# EAGLE design batt-monitor (EAGLE 5.12)
BOM: EXCLUDE; DATABASE: ./partsdb.txt; PARTNO: 1KSMB36CA

## Sheet 1 of 3
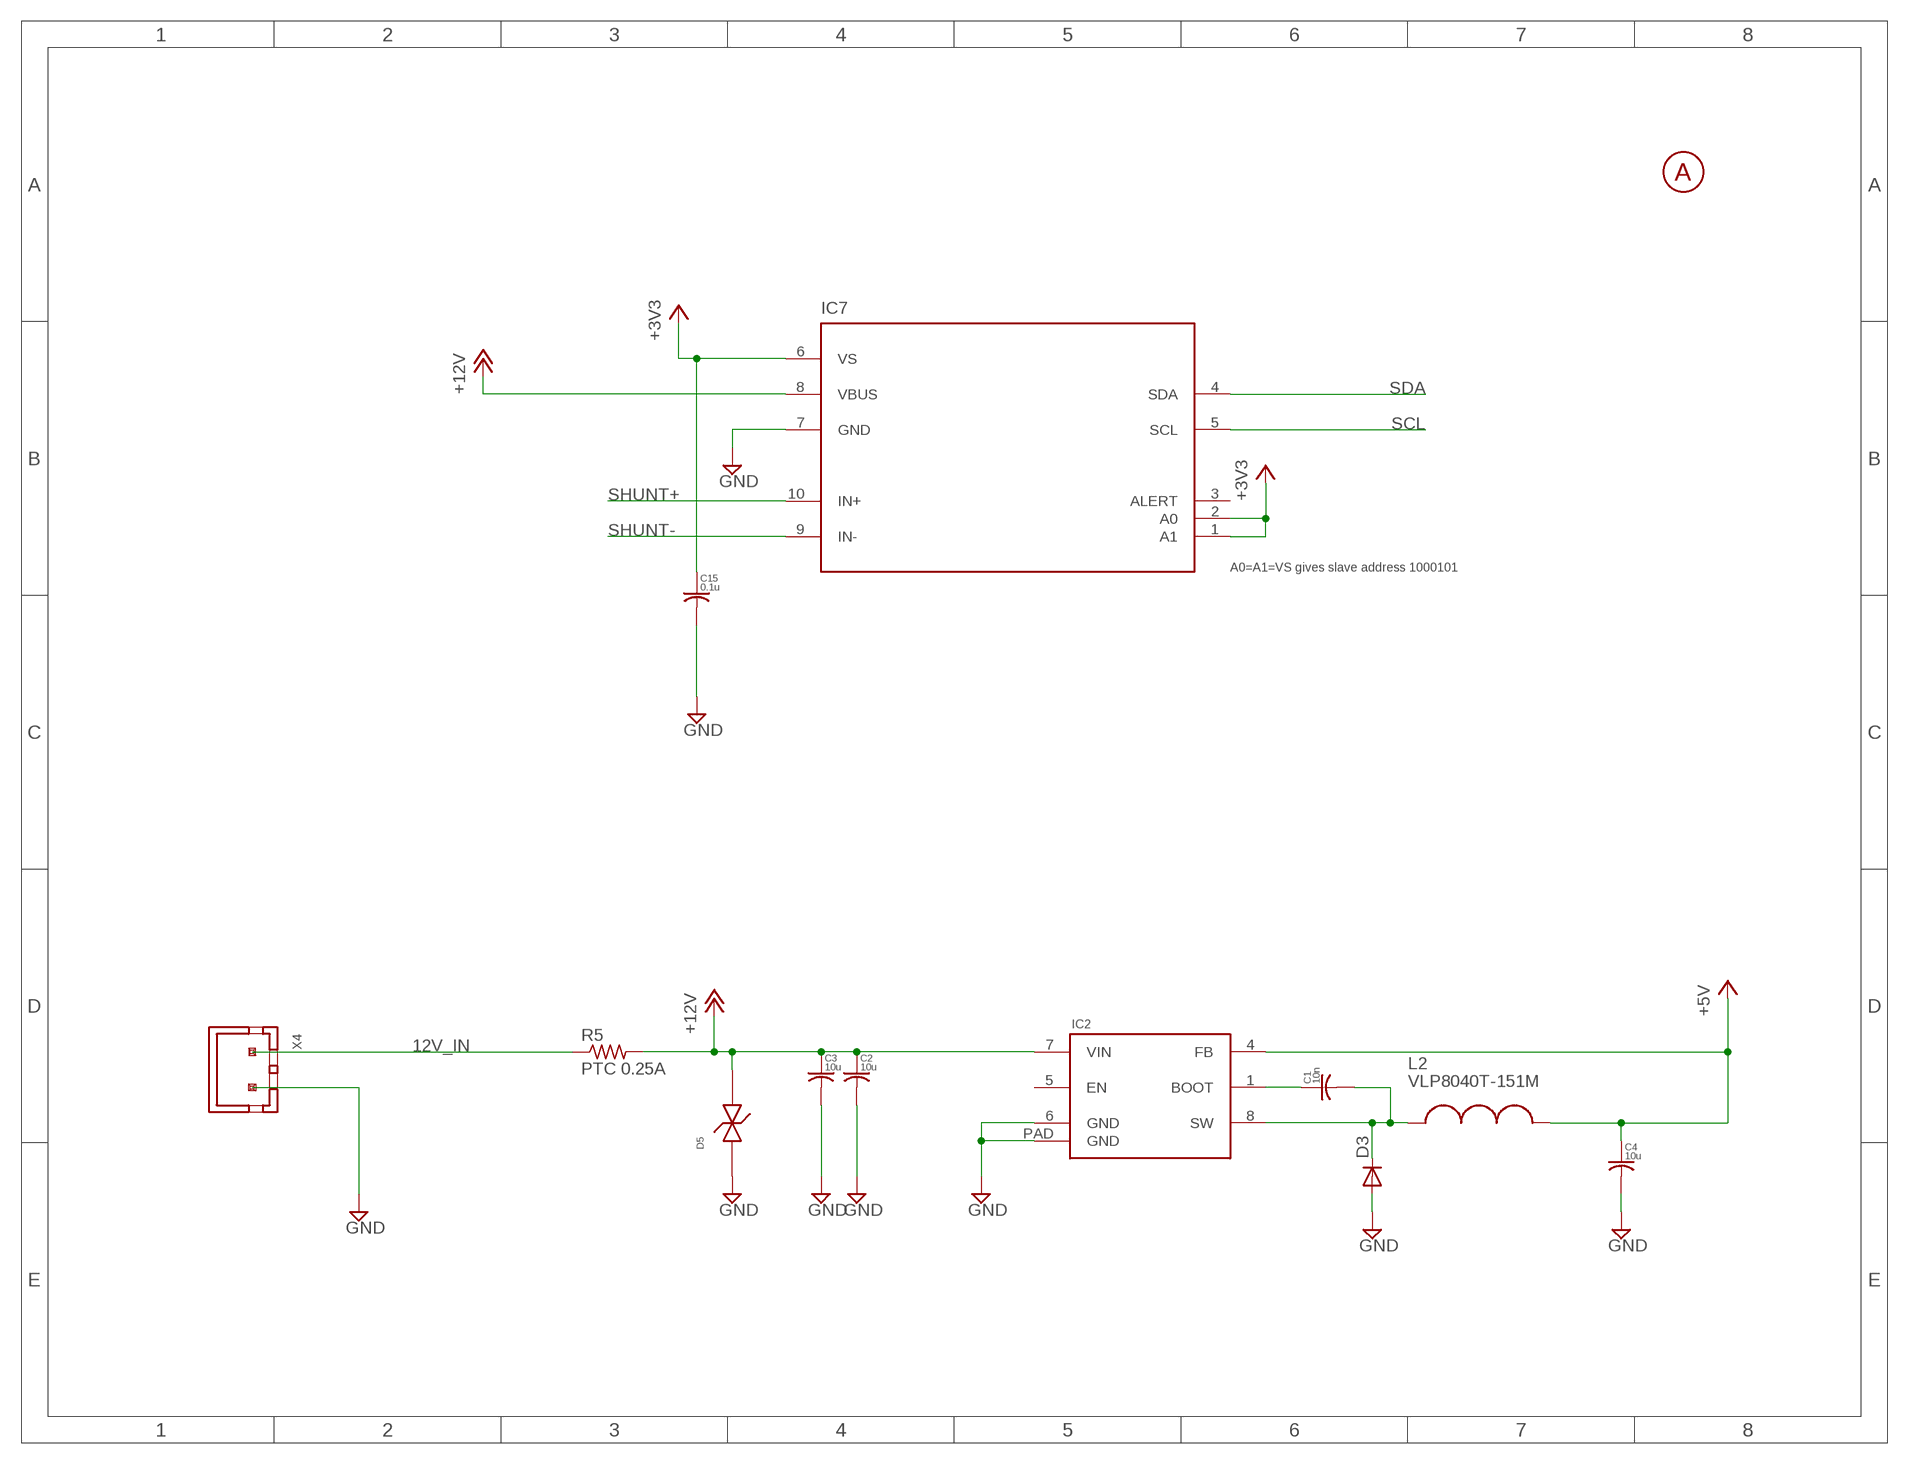
[diagram p0: schematic, sheet 1]

### Parts
C1  10n  C-USC0805  [C0805]
C2  10u  C-USC0805  [C0805]
C3  10u  C-USC0805  [C0805]
C4  10u  C-USC0805  [C0805]
C15  0.1u  C-USC0603  [C0603]
D3  DIODE-SOD123  [SOD123]
D5  SMBJ30CA  [DO-214AA]
IC2  LM22674  [LM22674]
IC7  INA233  [VSSOP-10]
L2  VLP8040T-151M  [VLP8040T-151M]
R5  PTC 0.25A  R-US_R0603  [R0603]
U$2  CIRCLE_A-0.3"  [CIRCLE_A-0.25"]
X4  XH-2CKT-RA  [S2B-XH-A]

### Nets
12V_IN: R5.1 X4.1
+3V3: C15.1 IC7.1(A1) IC7.2(A0) IC7.6(VS) ; also sheet 2,3
+5V: C4.1 IC2.4(FB) L2.2 ; also sheet 2
+12V: C2.1 C3.1 D5.2 IC2.7(VIN) IC7.8(VBUS) R5.2 ; also sheet 3
GND: C2.2 C3.2 C4.2 C15.2 D3.A D5.1 IC2.6(GND) IC2.PAD(GND) IC7.7(GND) X4.2 ; also sheet 2,3
N$6: C1.2 D3.C IC2.8(SW) L2.1
N$7: C1.1 IC2.1(BOOT)
SCL: IC7.5(SCL) ; also sheet 2
SDA: IC7.4(SDA) ; also sheet 2
SHUNT+: IC7.10(IN+)
SHUNT-: IC7.9(IN-)
Unconnected: IC2.5(EN) IC7.3(ALERT)

### Notes on the sheet
- A0=A1=VS gives slave address 1000101

## Sheet 2 of 3
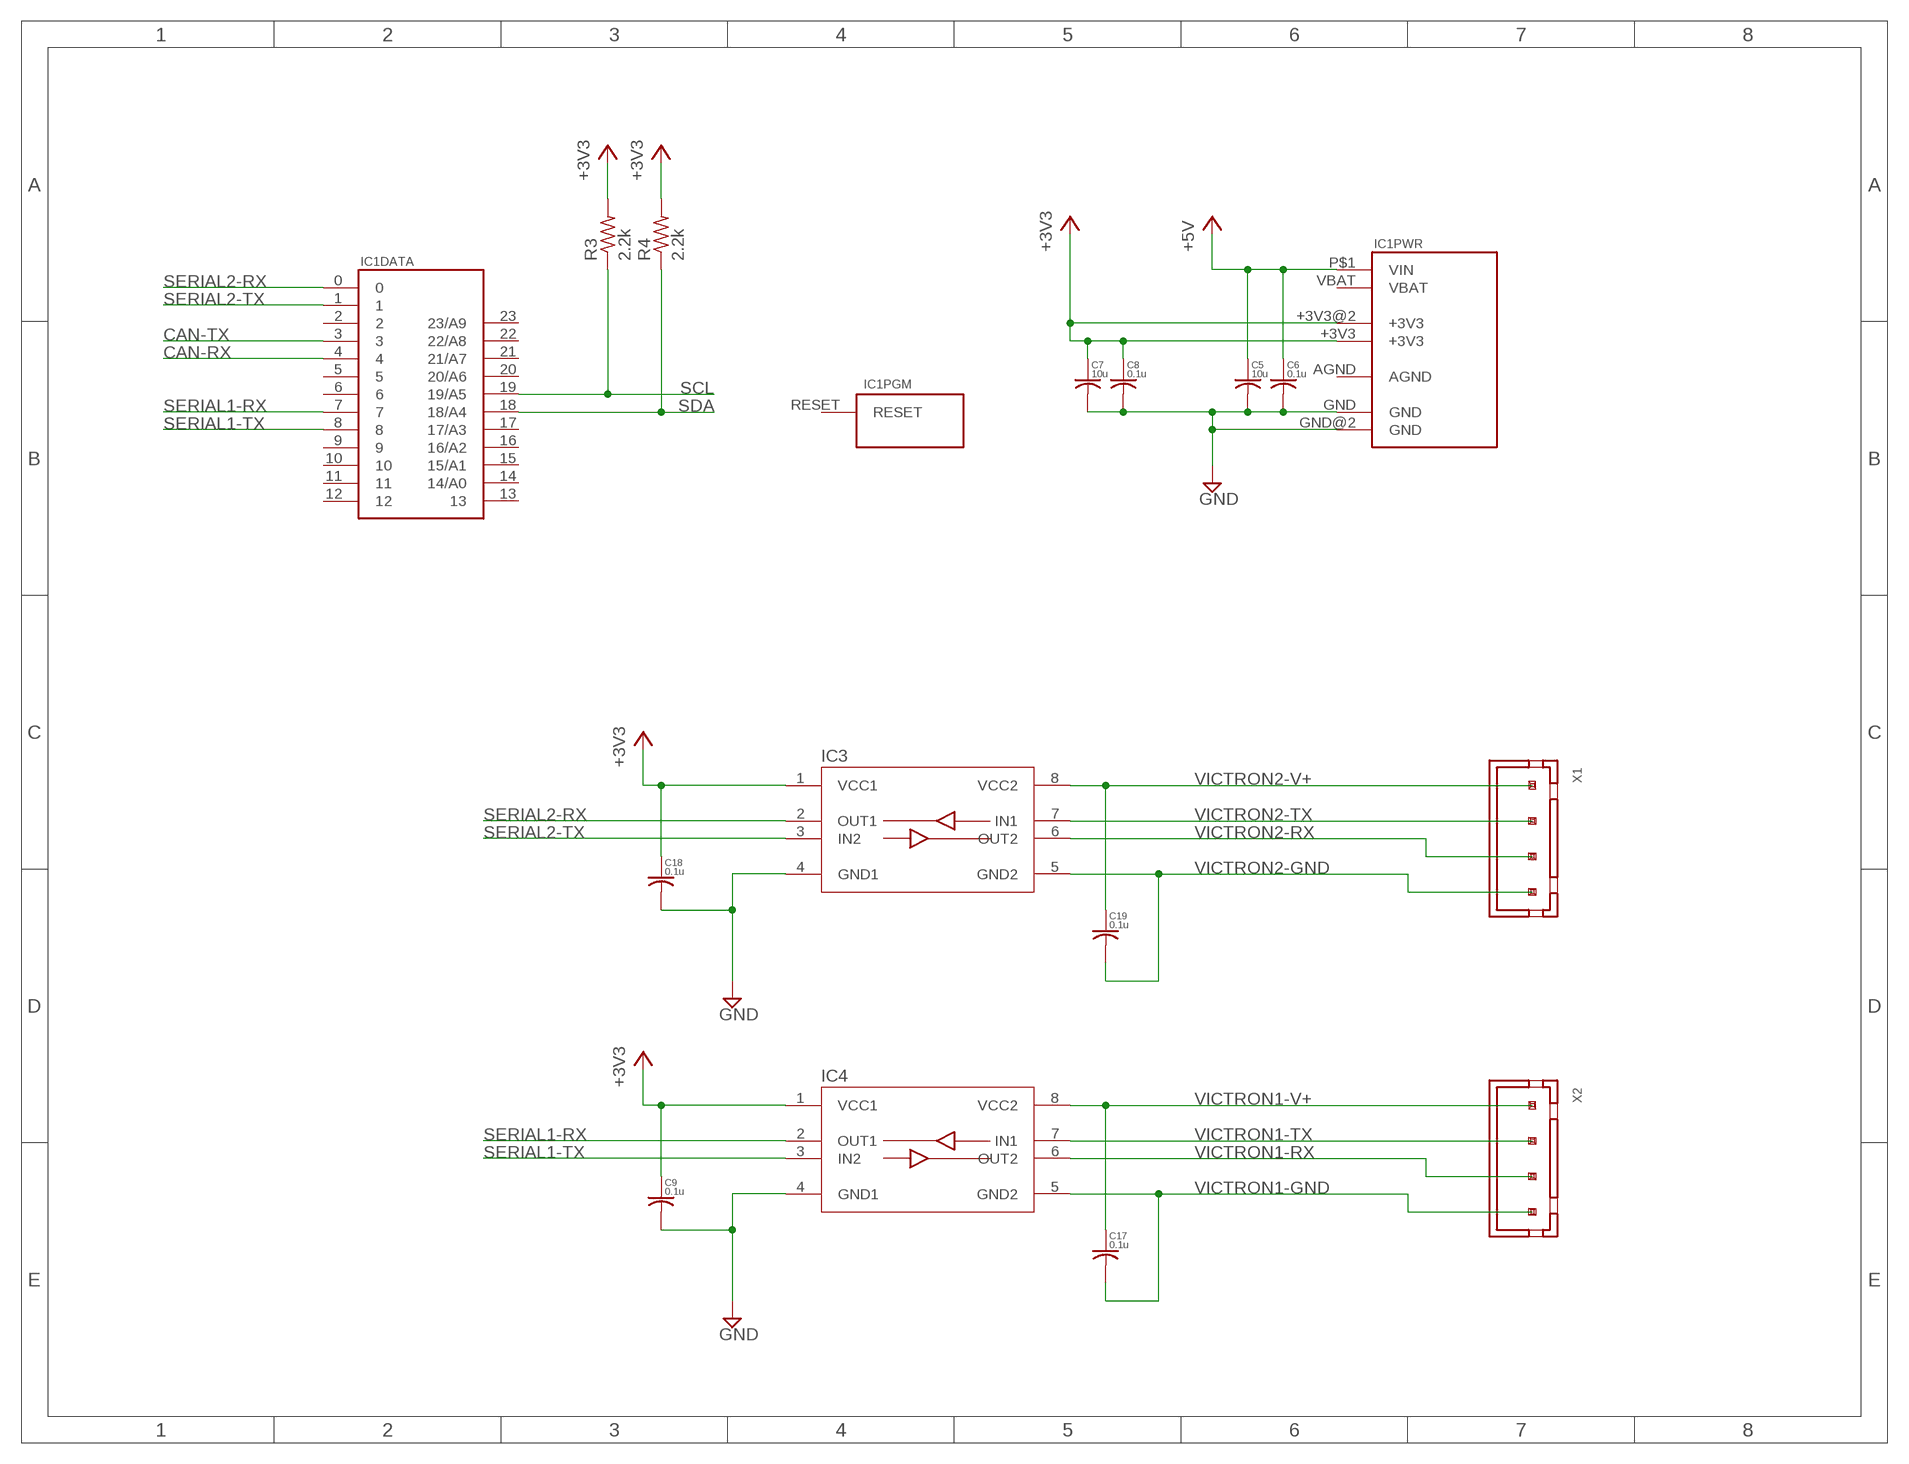
[diagram p1: schematic, sheet 2]

### Parts
C5  10u  C-USC0805  [C0805]
C6  0.1u  C-USC0603  [C0603]
C7  10u  C-USC0805  [C0805]
C8  0.1u  C-USC0603  [C0603]
C9  0.1u  C-USC0603  [C0603]
C17  0.1u  C-USC0603  [C0603]
C18  0.1u  C-USC0603  [C0603]
C19  0.1u  C-USC0603  [C0603]
IC1  TEENSY-3.2  [TEENSY-3.2]
IC3  ISO7421  [SOIC8]
IC4  ISO7421  [SOIC8]
R3  2.2k  R-US_R0603  [R0603]
R4  2.2k  R-US_R0603  [R0603]
X1  XH-4CKT-RA-THRU  [S4B-XH-A]
X2  XH-4CKT-RA-THRU  [S4B-XH-A]

### Nets
+3V3: C7.1 C8.1 C9.1 C18.1 IC1.+3V3(PWR:+3V3) IC1.+3V3@2(PWR:+3V3) IC3.1(VCC1) IC4.1(VCC1) R3.2 R4.2 ; also sheet 1,3
+5V: C5.1 C6.1 IC1.P$1(PWR:VIN) ; also sheet 1
CAN-RX: IC1.4 ; also sheet 3
CAN-TX: IC1.3 ; also sheet 3
GND: C5.2 C6.2 C7.2 C8.2 C9.2 C18.2 IC1.GND(PWR:GND) IC1.GND@2(PWR:GND) IC3.4(GND1) IC4.4(GND1) ; also sheet 1,3
SCL: IC1.19(DATA:19/A5) R3.1 ; also sheet 1
SDA: IC1.18(DATA:18/A4) R4.1 ; also sheet 1
SERIAL1-RX: IC1.7 IC4.2(OUT1)
SERIAL1-TX: IC1.8 IC4.3(IN2)
SERIAL2-RX: IC1.0 IC3.2(OUT1)
SERIAL2-TX: IC1.1 IC3.3(IN2)
VICTRON1-GND: C17.2 IC4.5(GND2) X2.4
VICTRON1-RX: IC4.6(OUT2) X2.3
VICTRON1-TX: IC4.7(IN1) X2.2
VICTRON1-V+: C17.1 IC4.8(VCC2) X2.1
VICTRON2-GND: C19.2 IC3.5(GND2) X1.4
VICTRON2-RX: IC3.6(OUT2) X1.3
VICTRON2-TX: IC3.7(IN1) X1.2
VICTRON2-V+: C19.1 IC3.8(VCC2) X1.1
Unconnected: IC1.2 IC1.5 IC1.6 IC1.9 IC1.10 IC1.11 IC1.12 IC1.13 IC1.14(DATA:14/A0) IC1.15(DATA:15/A1) IC1.16(DATA:16/A2) IC1.17(DATA:17/A3) IC1.20(DATA:20/A6) IC1.21(DATA:21/A7) IC1.22(DATA:22/A8) IC1.23(DATA:23/A9) IC1.AGND(PWR:AGND) IC1.RESET(PGM:RESET) IC1.VBAT(PWR:VBAT)

## Sheet 3 of 3
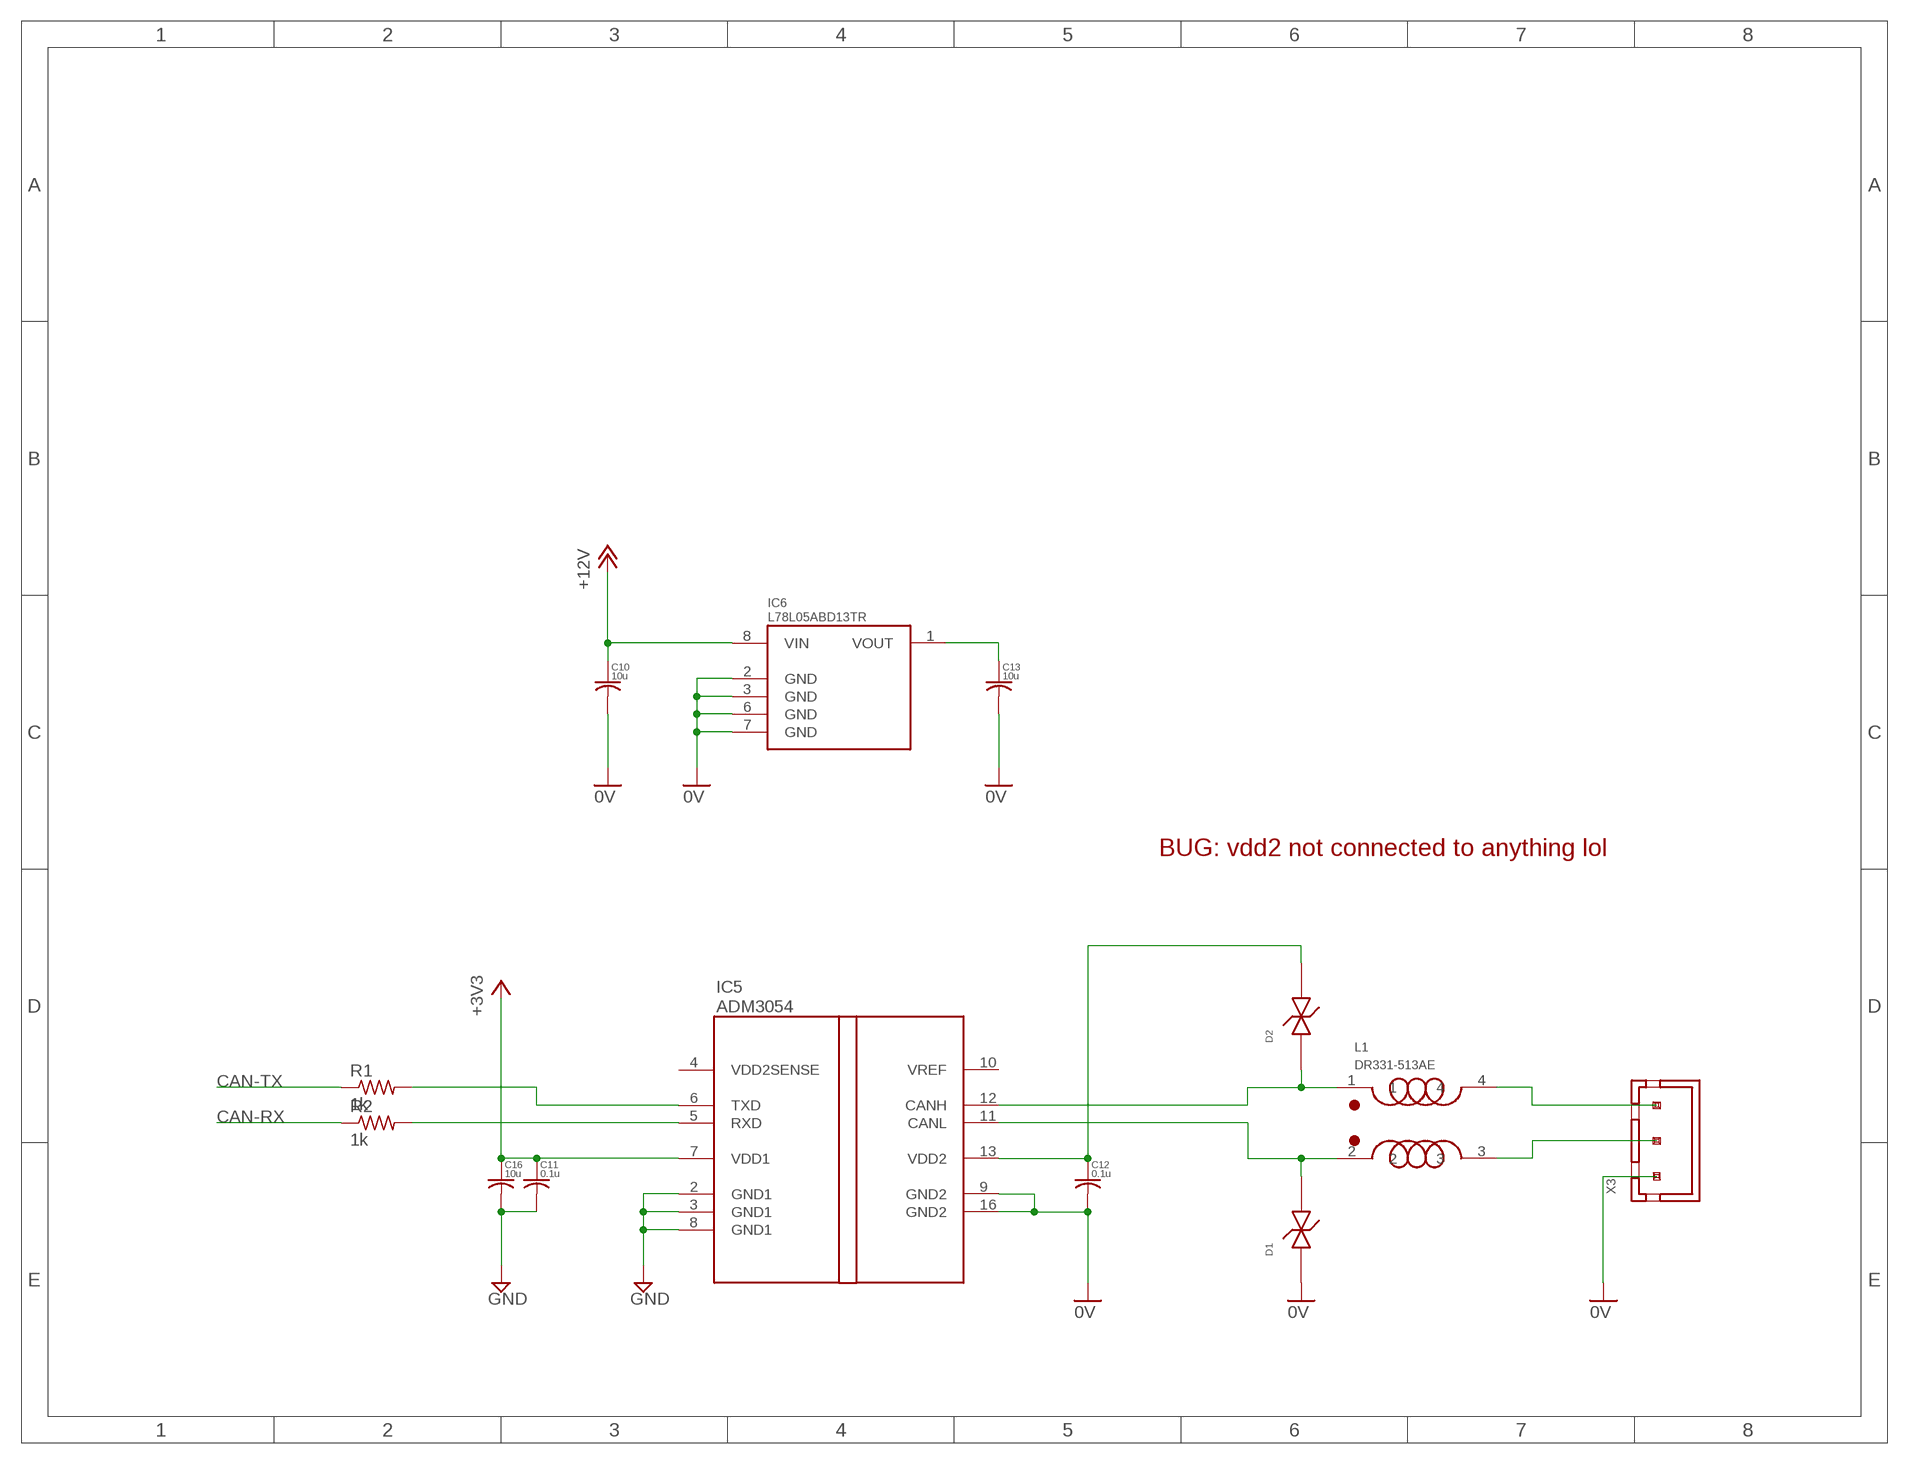
[diagram p2: schematic, sheet 3]

### Parts
C10  10u  C-USC0805  [C0805]
C11  0.1u  C-USC0603  [C0603]
C12  0.1u  C-USC0603  [C0603]
C13  10u  C-USC0805  [C0805]
C16  10u  C-USC0805  [C0805]
D1  SMBJ30CA  [DO-214AA]
D2  SMBJ30CA  [DO-214AA]
IC5  ADM3054  [SOIC-16]
IC6  L78L05  [SOIC8]
L1  DR331-513AE  [SMD]
R1  1k  R-US_R0603  [R0603]
R2  1k  R-US_R0603  [R0603]
X3  XH-3CKT-RA-THRU  [S3B-XH-A]

### Nets
0V: C10.2 C12.2 C13.2 D1.1 IC5.9(GND2) IC5.16(GND2) IC6.2(GND) IC6.3(GND) IC6.6(GND) IC6.7(GND) X3.1
+3V3: C11.1 C16.1 IC5.7(VDD1) ; also sheet 1,2
+12V: C10.1 IC6.8(VIN) ; also sheet 1
CAN-RX: R2.1 ; also sheet 2
CAN-TX: R1.1 ; also sheet 2
GND: C11.2 C16.2 IC5.2(GND1) IC5.3(GND1) IC5.8(GND1) ; also sheet 1,2
N$1: D2.1 IC5.12(CANH) L1.1
N$2: D1.2 IC5.11(CANL) L1.2
N$3: C12.1 D2.2 IC5.13(VDD2)
N$4: IC5.6(TXD) R1.2
N$8: L1.3 X3.2
N$9: L1.4 X3.3
N$10: C13.1 IC6.1(VOUT)
N$11: IC5.5(RXD) R2.2
Unconnected: IC5.4(VDD2SENSE) IC5.10(VREF)

### Notes on the sheet
- BUG: vdd2 not connected to anything lol

## Library data of the parts
C1-C13 C15-C19 = rcl:C-US: CAPACITOR, American symbol
D1 D2 D5 = Littelfuse:SMBJ30CA: Bidirectional TVS Zener Diode 30V Breakdown http://www.digikey.com/product-detail/en/SMBJ30CA/SMBJ30CALFCT-ND/286112; PARTNO: SMBJ30CALFCT-ND
D3 = diode:DIODE-: DIODE
IC1 = counter:TEENSY-3.2
IC2 = counter:LM22674
IC3 IC4 = counter:ISO7421; PARTNO: ISO7421MDREP
IC5 = counter:ADM3054; PARTNO: ADM3054WBRWZ
IC6 = counter:L78L; PARTNO: L78L05ABD13TR
IC7 = counter:INA233
L1 = Bourns:DR331-513AE: Bourns Common Mode Choke; PARTNO: DR331-513AECT-ND
L2 = counter:VLP8040T-151M; PARTNO: VLP8040T-151M
R1-R5 = rcl:R-US_: RESISTOR, American symbol
U$2 = magic-camper-node:CIRCLE_A
X1 X2 = JST:XH-4CKT: XH connector, 4 circuits Datasheet: http://www.jst-mfg.com/product/pdf/eng/eXH.pdf; PARTNO: S4B-XH-A
X3 = JST:XH-3CKT: XH connector, 3 circuits Datasheet: http://www.jst-mfg.com/product/pdf/eng/eXH.pdf Mating connector: XHP-3 Terminals: SXH-001T-P0.6 (28-22awg) SXH-002T-P0.6 (30-26awg); PARTNO: S3B-XH-A
X4 = JST:XH-2CKT: XH connector, 2 circuits Datasheet: http://www.jst-mfg.com/product/pdf/eng/eXH.pdf Mating connector: XHP-2 Terminals: SXH-001T-P0.6 (28-22awg) SXH-002T-P0.6 (30-26awg); PARTNO: S2B-XH-A

## Board
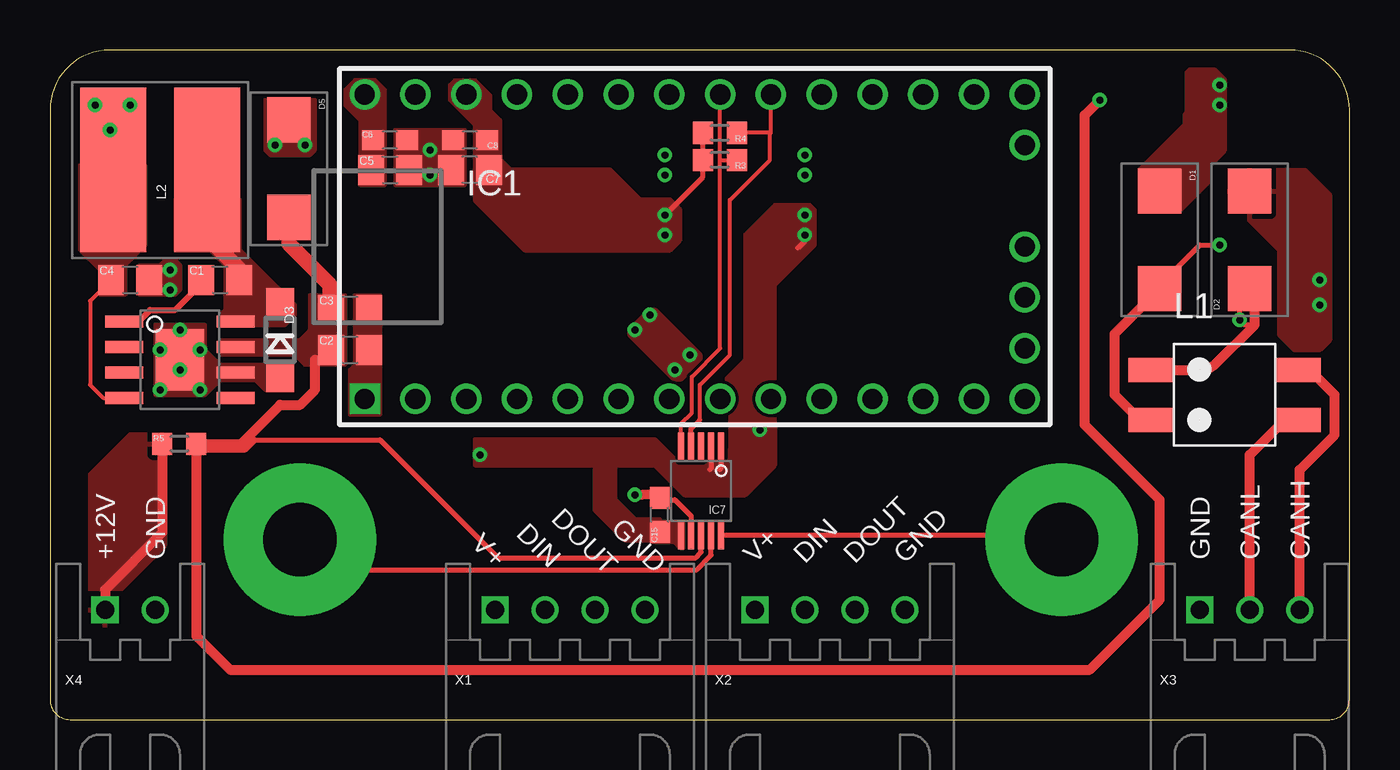
[diagram p3: board, top side]
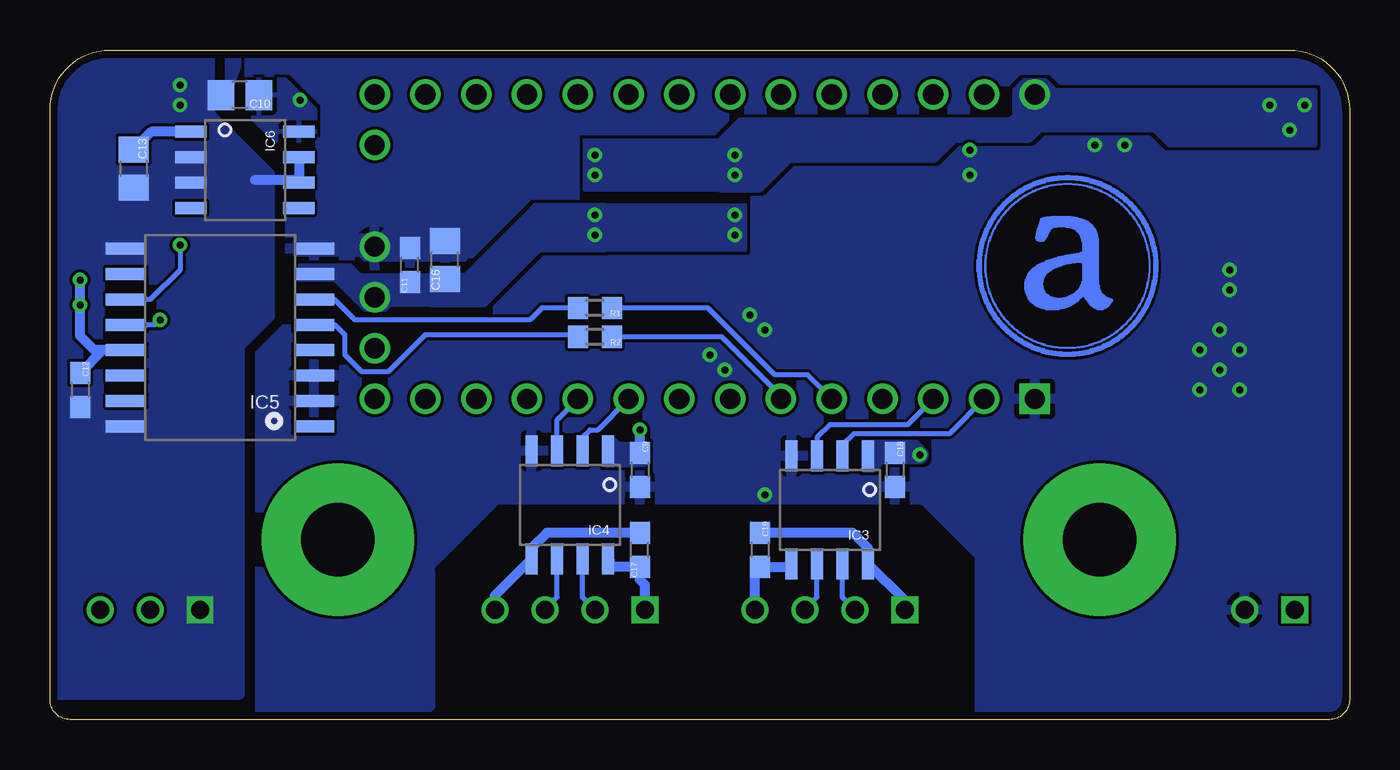
[diagram p4: board, bottom side, seen from below]

Size 65 x 33.5 mm. Coordinates in mm from the lower left corner, seen from the top.
Outline: 65,30.5 arc90 62,33.5 3,33.5 arc90 0,30.5 0,1 arc90 1,0 64,0 arc90 65,1 65,30.5
Copper layers (1*16): Top 0.0356mm / dielectric 1.5011mm / Bottom 0.0356mm
Design rules "OSH Park 2-layer *": minimum track width 6mil, minimum drill 13mil, track to track 6mil, track to pad 6mil, pad to pad 6mil, via to via 6mil, smd to smd 0mil, copper to edge 15mil, drill to drill 6mil, minimum pad ring 7mil, minimum via ring 7mil, stop-mask expansion 4mil, vias tented up to drill 25mil, thermal gap 10mil
tRestrict: 12 lines
bRestrict: 13 lines

### Footprints (pad centres in the part's own frame; a part is rotated, then mirrored left to right if it is on the bottom)
C0805 = smd 1.3 x 1.5: 1 -0.95,0; 2 0.95,0
C0603 = smd 1.1 x 1: 1 -0.85,0; 2 0.85,0
DO-214AA = smd 2.261 x 2.159: 1 -2.438,0; 2 2.438,0
SOD123 = smd 1.4 x 1.4: A 1.9,0; C -1.9,0
TEENSY-3.2 = drill 1.016 round: 0 3.81,-7.62; 1 6.35,-7.62; 2 8.89,-7.62; 3 11.43,-7.62; 4 13.97,-7.62; 5 16.51,-7.62; 6 19.05,-7.62; 7 21.59,-7.62; 8 24.13,-7.62; 9 26.67,-7.62; 10 29.21,-7.62; 11 31.75,-7.62; 12 34.29,-7.62; 13 34.29,7.62; 14 31.75,7.62; 15 29.21,7.62; 16 26.67,7.62; 17 24.13,7.62; 18 21.59,7.62; 19 19.05,7.62; 20 16.51,7.62; 21 13.97,7.62; 22 11.43,7.62; 23 8.89,7.62; +3V3 34.29,-2.54; +3V3@2 6.35,7.62; AGND 3.81,7.62; GND@2 34.29,0; P$1 1.27,7.62; RESET 34.29,5.08; VBAT 34.29,-5.08 | drill 1.016 square: GND 1.27,-7.62
LM22674 = smd 0.61 x 1.905: 1 -1.905,-2.781; 2 -0.635,-2.781; 3 0.635,-2.781; 4 1.905,-2.781; 5 1.905,2.781; 6 0.635,2.781; 7 -0.635,2.781; 8 -1.905,2.781 | smd 3.099 x 2.413: PAD 0,0
SOIC8 = smd 0.6 x 1.55: 1 -1.905,-2.7; 2 -0.635,-2.7; 3 0.635,-2.7; 4 1.905,-2.7; 5 1.905,2.7; 6 0.635,2.7; 7 -0.635,2.7; 8 -1.905,2.7
SOIC-16 = smd 0.6 x 2: 1 -5.08,-4.7; 2 -3.81,-4.7; 3 -2.54,-4.7; 4 -1.27,-4.7; 5 0,-4.7; 6 1.27,-4.7; 7 2.54,-4.7; 8 3.81,-4.7; 9 3.81,4.7; 10 2.54,4.7; 11 1.27,4.7; 12 0,4.7; 13 -1.27,4.7; 14 -2.54,4.7; 15 -3.81,4.7; 16 -5.08,4.7
VSSOP-10 = smd 0.3 x 1.45: 1 -1,-2.2; 2 -0.5,-2.2; 3 0,-2.2; 4 0.5,-2.2; 5 1,-2.2; 6 1,2.2; 7 0.5,2.2; 8 0,2.2; 9 -0.5,2.2; 10 -1,2.2
SMD = smd 2.21 x 1.2: 1 -3.7,1.25; 2 -3.7,-1.25; 3 3.7,-1.25; 4 3.7,1.25
VLP8040T-151M = smd 3.3 x 8.2: 1 -2.35,0; 2 2.35,0
R0603 = smd 1 x 1.1: 1 -0.85,0; 2 0.85,0
S4B-XH-A = drill 0.9 square: 1 -3.75,0 | drill 0.9 round: 2 -1.25,0; 3 1.25,0; 4 3.75,0
S3B-XH-A = drill 0.9 square: 1 -2.5,0 | drill 0.9 round: 2 0,0; 3 2.5,0
S2B-XH-A = drill 0.9 square: 1 -1.25,0 | drill 0.9 round: 2 1.25,0

### Placement (x,y rotation side)
C1  8.5,22 0 top
C2  15,18.5 0 top
C3  15,20.5 0 top
C4  4,22 0 top
C5  17,27.5 0 top
C6  17,29 0 top
C7  21,27.5 180 top
C8  21,29 180 top
C9  35.5,12.5 270 bottom
C10  55.5,31.25 180 bottom
C11  47,22.75 90 bottom
C12  63.5,16.5 270 bottom
C13  60.82,27.57 270 bottom
C15  30.5,10.25 90 top
C16  45.25,23 90 bottom
C17  35.5,8.5 90 bottom
C18  22.75,12.5 270 bottom
C19  29.5,8.5 270 bottom
D1  55.5,24 270 top
D2  60,24 90 top
D3  11.5,19 270 top
D5  11.95,27.56 270 top
IC1  14.47,23.66 0 top
IC2  6.5,18 270 top
IC3  26,10.5 180 bottom
IC4  39,10.75 180 bottom
IC5  56.5,19.75 90 bottom
IC6  55.25,27.5 270 bottom
IC7  32.57,11.44 180 top
L1  58.75,16.25 0 top
L2  5.5,27.5 180 top
R1  37.75,20.6 180 bottom
R2  37.75,19.15 180 bottom
R3  33.5,28 180 top
R4  33.5,29.35 180 top
R5  6.47,13.8 0 top
U$2  18.75,18 0 bottom
X1  26,5.5 0 top
X2  39,5.5 0 top
X3  60,5.5 0 top
X4  4,5.5 0 top

### Tracks (layer width: path | path; a pad name or v marks a point on that pad's centre or on a via)
0V  (via drill 0.35)
  Bottom 0.5: IC6.7 IC6.6 52.69,27 54.75,27
  other vias: 58.5,31.75 58.5,30.75
  pour Bottom (rank 2, no thermals): 55.5,1.25 55.5,15.5 55,16.25 55,18.5 53.5,20 53.5,27.25 56.5,30.25 56.5,30.5 55,34.5 65.5,34.25 65.5,1.25
  pour Top (no thermals): 54.5,25.5 56.5,25.5 58,27 58,27.75 58.75,28.5 58.75,32 58.25,32.5 57,32.5 56.75,32.25 56.75,29.75 54.5,27.5
12V_IN
  Top 0.5: X4.1 2.75,6.5 5.62,9.37 R5.1
  pour Top: 3.25,4.75 3.25,6.25 5.75,8.75 5.75,14.25 4,14.25 2,12.25 2,4.75
+3V3  (via drill 0.35)
  Top 0.25: 37.4,23.6 37.75,23.95 v37.75,24.25 | R4.2 R3.2 32.65,27.15 v30.75,25.25 | IC7.1 33.57,12.57 33.5,12.5 | IC7.2 33.07,12.57 33,12.5
  Bottom 0.5: C9.1 v35.5,14.5
  other vias: 21.5,13.25 30.75,24.25 37.75,25.25
  pour Bottom (no thermals): 52.5,22.75 50,22.75 49.5,22.25 44.5,22.25 44.5,21 44.75,20.75 48,20.75 48.25,20.5 49.25,20.5 50.75,22 52.5,22
  pour Top (rank 2, no thermals): 21.25,26.75 21.25,29.75 20,31 20,31.75 20.25,32 21.25,32 21.5,31.75 22,31.25 22,30.5 22.5,30 22.5,26.75
  pour Bottom (rank 2, no thermals): 24.3,13.9 21.7,13.9 21.2,13.4 21.2,13.1 21.4,12.9 23.4,12.9 23.8,12.5 24.3,12.5
  pour Top (rank 2, no thermals): 31.7,9.9 30.1,9.9 30.1,8.9 31.2,8.9 31.5,8.6 31.7,8.6
  pour Bottom (rank 2, no thermals): 35.1,13.8 36.55,13.8 36.75,14 37.25,14 37.25,12.75 35.25,12.75 35.1,12.9 35.1,13.6 35.25,13.75 35.15,13.75
  pour Bottom (rank 2, no thermals): 30.25,25.75 30.25,23.5 38.25,23.5 38.25,25.75
  pour Bottom (rank 2, no thermals): 37.25,25.75 40.75,25.75 44.25,22.25 46,22.25 46,20.75 43.25,20.75 40.5,23.5 37.25,23.5
  pour Top (rank 2, no thermals): 30.75,23.5 31,23.5 31.5,24 31.5,25.5 31,26 29.5,26 28,27.5 23,27.5 22.5,28 21.25,28 21.25,26 23.75,23.5
  pour Top (no thermals): 21.25,12.75 30.25,12.75 31.75,11.25 34.75,11.25 36.25,12.75 36.25,14.75 36,15 35.5,15 34,13.5 34,13 33.75,12.75 31.5,12.75 30.25,14 21.25,14
  pour Top (no thermals): 30.5,10 29.25,10 28.25,11 28.25,13 27.25,13 27.25,10.5 28.75,9 30.5,9
  pour Top (no thermals): 36.25,14 36.25,21.75 38.25,23.75 38.25,25.5 38,25.75 36.25,25.75 34.75,24.25 34.75,18 33.75,17 33.75,15.75 34,15.5 34,13.5 35.75,13.5
+5V  (via drill 0.35)
  Top 0.2: IC2.4 2.65,16.09 2,16.75 2,20.95 C4.1
  Top 0.25: L2.2 3,27.65 v3,29.5
  other vias: 37.75,28.25 37.75,27.25 30.75,28.25 30.75,27.25 2.25,30.75 4,30.75
  pour Top (rank 2, no thermals): 16.75,26.75 16.75,31.5 16.25,32 15.25,32 14.75,31.5 14.75,30.75 15.5,30 15.5,26.75
  pour Top (rank 2, no thermals): 4.75,27.75 4.75,23.75 3.75,22.75 3.75,21.25 2.5,21.25 2.5,22.5 1.5,23.5 1.5,27.75
  pour Bottom (rank 2, no thermals): 38.25,26.5 38.25,29 30.25,29 30.25,26.5
  pour Bottom (rank 2, no thermals): 15.25,32 14.75,31.5 1.75,31.5 1.75,28.75 9,28.75 9.75,29.5 16,29.5 16.75,30.25 16.75,31.5 16.25,32
  pour Bottom (rank 2, no thermals): 16.25,31 16.25,30.75 17,30 30.5,30 31.5,29 31.5,26.5 29.5,26.5 28,28 20.75,28 19.75,29 16,29 15.5,29.5 15.5,31
+12V  (via drill 0.35)
  Top 0.25: IC7.8 32.57,8.37 32.3,8.1 22.4,8.1 16.5,14 10.25,14 9.75,13.5 7.62,13.5 R5.2
  Top 0.5: C2.1 14.25,18.5 13.75,18 13.25,18 13.25,16.5 12.5,15.75 11.5,15.75 9.55,13.8 R5.2 7.32,4.18 9,2.5 52,2.5 55.5,6 55.5,11 51.75,14.75 51.75,30.25 v52.5,31
  Top 0.75: D5.2 11.95,23.8 14,21.75 14,20.55 C3.1
  pour Top (no thermals): 8.5,19 12.5,19 13,19.5 13,21.25 14.75,21.25 14.75,17.75 12.75,17.75 12.25,18.25 8.5,18.25
  pour Bottom: 55,32 55,30.25 53.75,29 51.75,29 51.75,30.5 53.25,32
CAN-RX
  Bottom 0.25: R2.1 31.4,19.15 28.5,16.25 28.5,16.1 IC1.4
CAN-TX
  Bottom 0.25: R1.1 32.1,20.6 28.75,17.25 27.11,17.25 IC1.3
GND  (via drill 0.35)
  Top 0.25: IC7.7 32.07,10.18 31.25,11 30.6,11 C15.2
  Top 0.5: C15.2 30.75,11.35 v29.25,11.25
  other vias: 19,27.25 19,28.5 5.5,16.5 7.5,16.5 6.5,19.5 6.5,17.5 5.5,18.5 7.5,18.5 6,22.5 6,21.5 11.25,28.75 12.75,28.75 32,18.25 31.25,17.5 29.25,19.5 30,20.25
  pour Bottom (rank 4): -1,34.5 66.5,34.5 66.5,-1 -1,-1
  pour Top (no thermals): 12,17.75 8.5,17.75 7.75,18.5 7.75,19.75 5.25,19.75 5.25,16.25 7.75,16.25 8.5,17 10.25,17 10.75,16.5 12,16.5
  pour Top (no thermals): 16.5,21.25 16.5,15.25 15,15.25 15,16.75 15,17.5 15.25,17.75 15.25,21.25
  pour Top (no thermals): 17.25,26.75 20.75,26.75 20.75,29.5 17.25,29.5
  pour Bottom (rank 3, no thermals): 52.75,24.25 48.5,24.25 47.5,25.25 44.25,25.25 44.25,23 49.25,23 49.5,23.25 52.75,23.25
  pour Top (rank 2, no thermals): 4.5,22.75 5.5,22.75 5.75,23 6.25,23 6.5,22.75 6.5,21.5 6.25,21.25 4.5,21.25
  pour Top (rank 2, no thermals): 10.75,31 10.75,28.5 11,28.25 13,28.25 13.25,28.5 13.25,31
  pour Top (no thermals): 30,20.5 30.25,20.5 32.5,18.25 32.5,18 31.5,17 31.25,17 29,19.25 29,19.5
N$1  (via drill 0.35)
  Top 0.25: D2.1 59.5,21.06 v59.5,20 59.75,19.75 60.25,19.75
  Top 0.5: L1.1 57.59,17.5 arc45 58.29,17.79 60.25,19.75 60.25,20.96 arc45 D2.1
  Bottom 0.25: 59.56,20.06 v59.5,20 59.75,19.75 IC5.12
N$2  (via drill 0.35)
  Top 0.25: v58.5,23.75 57.5,23.75 55.5,21.75
  Top 0.5: 55.5,21.75 D1.2 53.25,19.31 53.25,16.25 54.21,15.29 arc45 54.91,15 L1.2
  Bottom 0.25: IC5.11 59.98,21.02 58.5,22.5 v58.5,23.75
N$3  (via drill 0.35)
  Bottom 0.5: C12.1 62.37,18.48 IC5.13 61.22,18.5 62.8,18.5 63.5,19.2 v63.5,22
  other vias: 63.5,20.75
  pour Top: 59,27.5 62.75,27.5 64,26.25 64,19 63.5,18.5 62.25,18.5 61.5,19.25 61.5,23.5 59,26
N$4
  Bottom 0.25: IC5.6 50.77,21.02 49.75,20 41,20 40.4,20.6 R1.2
N$6
  Top 0.75: L2.1 7.85,25.15 8,25 8,24 9.5,22.5 9.5,22.25 9.25,22 C1.2
  pour Top (no thermals): 8.5,19.75 10.25,19.75 11.75,19.75 12.25,20.25 12.25,20.75 9.5,23.5 9.5,26 6.25,26 6.25,23.5 8,23.5 8.75,22.75 8.75,21.25 8.75,20.5 8.5,20.25
N$7
  Top 0.3: C1.1 7.55,21.8 6.25,20.5 5,20.5 4.5,20 3.81,20 IC2.1
N$8
  Top 0.5: 60,5.25 X3.2 60,13.25 61.75,15 L1.3
N$9
  Top 0.5: L1.4 63,17.5 64.25,16.25 64.25,14.25 62.5,12.5 X3.3
N$10
  Bottom 0.5: C13.1 59.94,29.41 IC6.1
N$11
  Bottom 0.25: IC5.5 50.75,19.75 50.25,19.25 50.25,18.25 49.4,17.4 48.1,17.4 46.25,19.25 38.75,19.25 38.65,19.15 R2.2
SCL
  Top 0.2: IC7.5 31.57,14.82 32.1,15.35 32.1,17.15 33.52,18.57 33.52,28 | 33.52,28 IC1.19 | 33.52,28 R3.1
SDA
  Top 0.2: 32.5,15 32.5,16.75 34,18.25 34,26 36,28 36,29.35 | IC1.18 36.06,29.35 36,29.35 | 36,29.35 R4.1
  Top 0.25: IC7.4 32.07,14.57 32.5,15
SERIAL1-RX
  Bottom 0.25: IC1.7 37.6,14.5 38,14.5 38.36,14.13 IC4.2
SERIAL1-TX
  Bottom 0.25: IC1.8 39.57,15.07 39.64,15 IC4.3
SERIAL2-RX
  Bottom 0.25: IC3.2 25.37,13.73 24.8,14.3 20.02,14.3 IC1.0
SERIAL2-TX
  Bottom 0.25: IC3.3 26.63,14.12 26,14.75 22.11,14.75 IC1.1
SHUNT+  (via drill 3.66 pad 7.62)
  Top 0.25: IC7.10 50.25,9.25 50.5,9 v50.6,9
SHUNT-  (via drill 3.66 pad 7.62)
  Top 0.25: IC7.9 33.07,8.22 32.35,7.5 14,7.5 v12.5,9
VICTRON1-GND
  Bottom 0.5: C17.2 40.15,9.35 40.91,8.6 IC4.5 42.75,6.21 X2.4
VICTRON1-RX
  Bottom 0.25: IC4.6 39.64,6.12 X2.3
VICTRON1-TX
  Bottom 0.25: IC4.7 38.36,6.12 X2.2
VICTRON1-V+
  Bottom 0.5: X2.1 35.25,6.75 35.5,7 C17.1 36.85,7.65 37,7.5 37,7.96 IC4.8
VICTRON2-GND
  Bottom 0.5: X1.4 29.75,7.4 C19.2 28.05,7.65 IC3.5
VICTRON2-RX
  Bottom 0.25: IC3.6 26.63,6.12 X1.3
VICTRON2-TX
  Bottom 0.25: IC3.7 25.37,6.12 X1.2
VICTRON2-V+
  Bottom 0.5: X1.1 22.25,5.96 IC3.8 24.09,8.6 24.85,9.35 C19.1

### Text on the board
tPlace: DOUT | V+ | DIN | GND | +12V | GND | V+ | DIN | DOUT | GND | GND | CANL | CANH